# EasyEDA schematic SCH_vga1306-v3_2021-08-20.json
TITLE: Sheet_1; REV: 1.0; Date: 2021-06-19; Sheet: 1/1; Drawn By: ande3367; Company: Your Company
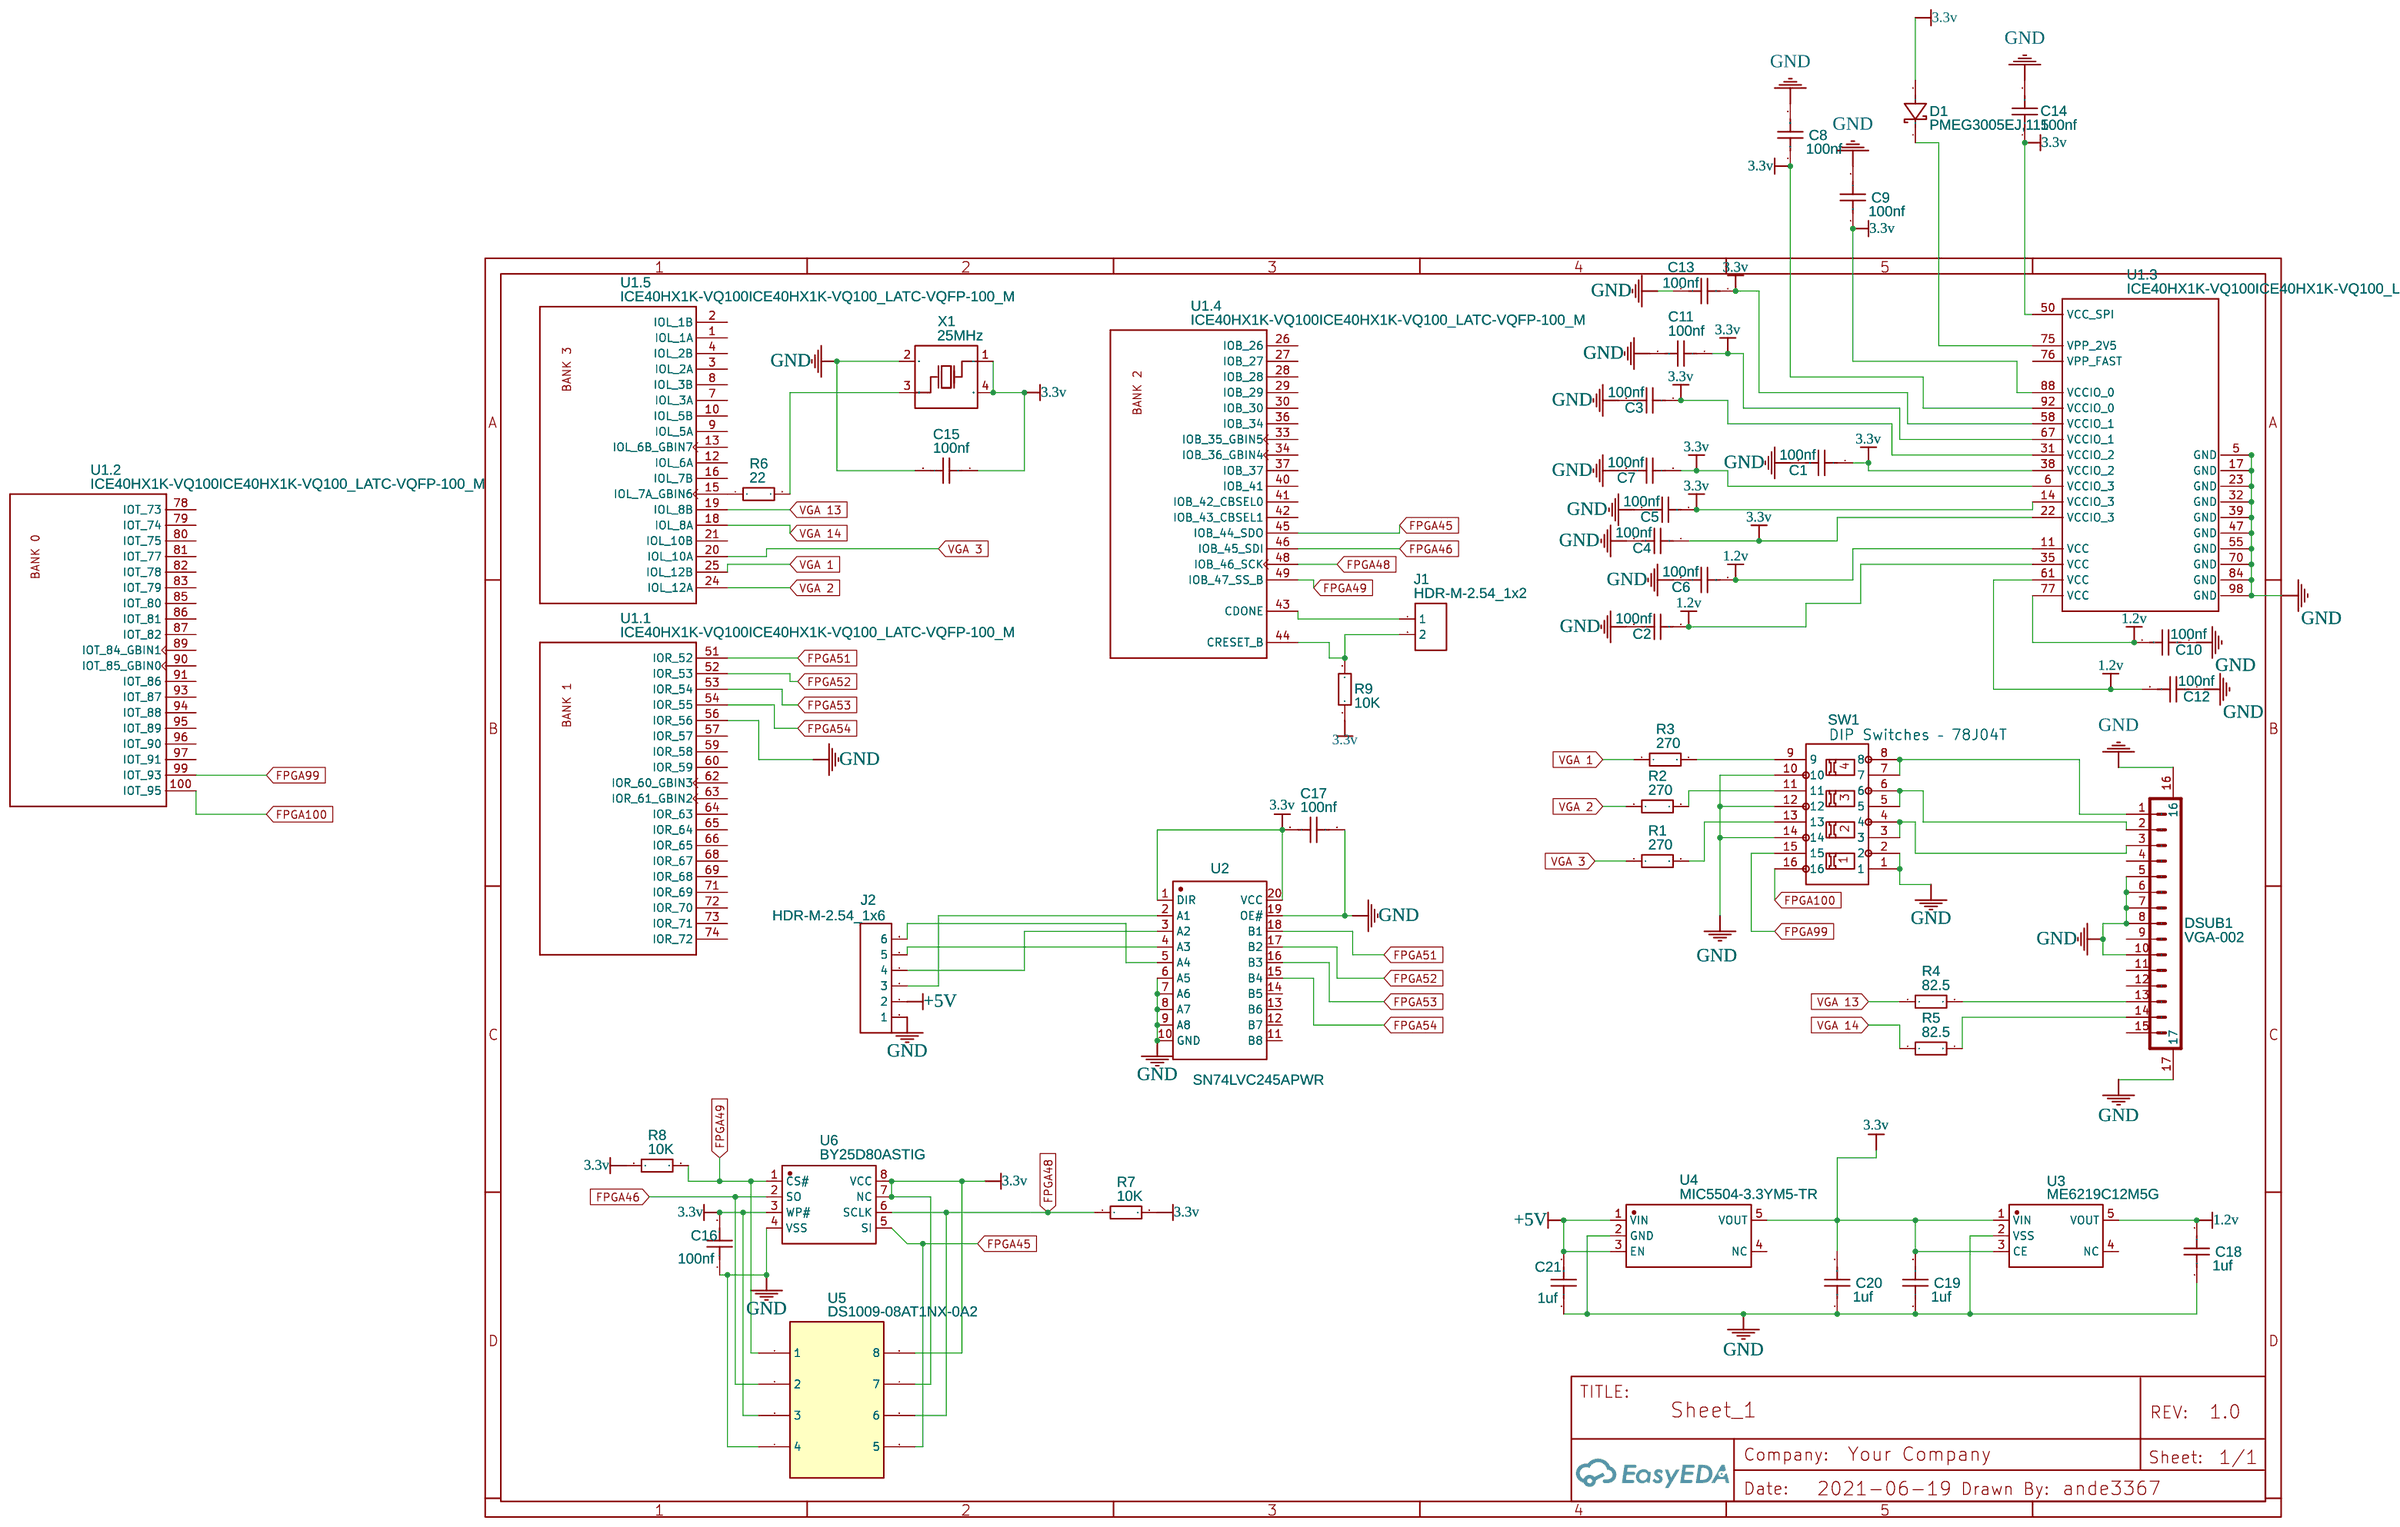
[diagram p0: schematic sheet]

## Parts
C1  100nf  [0603]
C2  100nf  [0603]
C3  100nf  [0603]
C4  100nf  [0603]
C5  100nf  [0603]
C6  100nf  [0603]
C7  100nf  [0603]
C8  100nf  [0603]
C9  100nf  [0603]
C10  100nf  [0603]
C11  100nf  [0603]
C12  100nf  [0603]
C13  100nf  [0603]
C14  100nf  [0603]
C15  100nf  [0603]
C16  100nf  [0603]
C17  100nf  [0603]
C18  1uf  [0603]
C19  1uf  [0603]
C20  1uf  [0603]
C21  1uf  [0603]
D1  PMEG3005EJ,115  [SOD-323F_L2.0-W1.6-LS2.5-RD]
DSUB1  VGA-002  [D-SUB-TH_VGA-002]
J1  HDR-M-2.54_1x2  [HDR-M-2.54_1X2]
J2  HDR-M-2.54_1x6  [HDR-M-2.54_1X6]
R1  270  [R0603]
R2  270  [R0603]
R3  270  [R0603]
R4  82.5  [R0603]
R5  82.5  [R0603]
R6  22  [R0603]
R7  10K  [R0603]
R8  10K  [R0603]
R9  10K  [R0603]
SW1  DIP Switches – 78J04T  [DIP SWITCHES – 78J04T]
U1  ICE40HX1K-VQ100ICE40HX1K-VQ100_LATC-VQFP-100_M  [LATC-VQFP-100_M]  (sections 1,2,3,4,5)
U2  SN74LVC245APWR  [TSSOP-20_L6.5-W4.4-P0.65-LS6.4-BL]
U3  ME6219C12M5G  [SOT-23-5_L3.0-W1.7-P0.95-LS2.8-BR]
U4  MIC5504-3.3YM5-TR  [SOT-23-5_L3.0-W1.7-P0.95-LS2.8-TL]
U5  DS1009-08AT1NX-0A2  [DIP-8_L10.0-W6.5-P2.54-LS7.6-BL]
U6  BY25D80ASTIG  [SOP-8_L4.9-W3.9-P1.27-LS6.0-BL]
X1  25MHz  [OSC-SMD_4P-L3.2-W2.5-BL]

## Library data of the parts
C1-C17 = Cap_0603_US: Supplier Part: C92490; Supplier: LCSC
C18-C21 = Cap_0603_US: Supplier Part: C26413; Supplier: LCSC
D1 = PMEG3005EJ,115: Supplier: LCSC; Supplier Part: C552853; Manufacturer: Nexperia; Contributor: LCSC
DSUB1 = VGA-002: Supplier: LCSC; Manufacturer: BOOMELE; Supplier Part: C138387; JLCPCB Part Class: Extended Part
J1 = HDR-M-2.54_1x2: Supplier Part: C124375; Supplier: LCSC; Contributor: LCEDA_Lib
J2 = HDR-M-2.54_1x6: Supplier Part: C190819; Supplier: LCSC; Contributor: LCEDA_Lib
R1-R3 = PTFR0603B270RP9: Supplier: LCSC; Supplier Part: C351661; Manufacturer: ResistorToday; Contributor: LCSC; JLCPCB Part Class: Extended Part
R4 R5 = 0603WAF825JT5E_C23117: Supplier: LCSC; Manufacturer: UniOhm; Manufacturer Part: 0603WAF825JT5E; Supplier Part: C23117; JLCPCB Part Class: Extended Part
R6 = 0603WAF220JT5E: Supplier: LCSC; Manufacturer: UniOhm; Supplier Part: C23345; JLCPCB Part Class: Basic Part
R7-R9 = 0603WAF1002T5E: Supplier: LCSC; Manufacturer: UniOhm; Supplier Part: C25804; JLCPCB Part Class: Basic Part
SW1 = DIP Switches – 78J04T: Manufacturer Part: DIP Switches – 78J06T; Contributor: components
U1 = ICE40HX1K-VQ100ICE40HX1K-VQ100_LATC-VQFP-100_M: Contributor: Darwin Sanjaya; subpart_no: 3; Supplier: LCSC; Supplier Part: C1519043
U2 = SN74LVC245APWR: Supplier: LCSC; Manufacturer: TI; Supplier Part: C7848; JLCPCB Part Class: Extended Part
U3 = ME6219C12M5G: Supplier: LCSC; Supplier Part: C236651; Manufacturer: Nanjing Micro One Elec; Contributor: LCSC; JLCPCB Part Class: Extended Part
U4 = MIC5504-3.3YM5-TR: Supplier: LCSC; Manufacturer: MICROCHIP; Contributor: LCSC; Supplier Part: C88419; JLCPCB Part Class: Extended Part
U5 = DS1009-08AT1NX-0A2: Supplier: LCSC; Manufacturer: CONNFLY; Supplier Part: C72124; JLCPCB Part Class: Extended Part
U6 = BY25D80ASTIG: Supplier: LCSC; Supplier Part: C383790; Manufacturer: BOYAMICRO; Contributor: LCSC; JLCPCB Part Class: Extended Part
X1 = S3225000151040: Supplier: LCSC; Supplier Part: C426979; Manufacturer: JGHC; Contributor: LCSC

## Nets
1.2v: C2.1 C6.1 C10.2 C12.2 C18.2 U1.11(VCC) U1.35(VCC) U1.61(VCC) U1.77(VCC) U3.5(VOUT)
3.3v: C1.1 C3.1 C4.1 C5.1 C7.1 C8.1 C9.1 C11.1 C13.1 C14.1 C15.1 C16.2 C17.2 C19.2 C20.2 D1.2(A) R7.2 R8.1 R9.1 U1.6(VCCIO_3) U1.14(VCCIO_3) U1.22(VCCIO_3) U1.31(VCCIO_2) U1.38(VCCIO_2) U1.50(VCC_SPI) U1.58(VCCIO_1) U1.67(VCCIO_1) U1.88(VCCIO_0) U1.92(VCCIO_0) U2.1(DIR) U2.20(VCC) U3.1(VIN) U3.3(CE) U4.5(VOUT) U5.3 U5.7 U5.8 U6.3(WP#) U6.7(NC) U6.8(VCC) X1.1(OSC1) X1.4(GND)
+5V: C21.2 J2.2 U4.1(VIN) U4.3(EN)
GND: C1.2 C2.2 C3.2 C4.2 C5.2 C6.2 C7.2 C8.2 C9.2 C10.1 C11.2 C12.1 C13.2 C14.2 C15.2 C16.1 C17.1 C18.1 C19.1 C20.1 C21.1 DSUB1.5 DSUB1.6 DSUB1.7 DSUB1.8 DSUB1.10 DSUB1.16 DSUB1.17 J2.1 SW1.1 SW1.2 SW1.10 SW1.12 SW1.14 U1.5(GND) U1.17(GND) U1.23(GND) U1.32(GND) U1.39(GND) U1.47(GND) U1.55(GND) U1.56(IOR) U1.70(GND) U1.84(GND) U1.98(GND) U2.6(A5) U2.7(A6) U2.8(A7) U2.9(A8) U2.10(GND) U2.19(OE#) U3.2(VSS) U4.2(GND) U5.4 U6.4(VSS) X1.2(GND)
FPGA45: U1.45(IOB_44_SDO) U5.5 U6.5(SI)
FPGA46: U1.46(IOB_45_SDI) U5.2 U6.2(SO)
FPGA48: R7.1 U1.48(IOB_46_SCK) U5.6 U6.6(SCLK)
FPGA49: R8.2 U1.49(IOB_47_SS_B) U5.1 U6.1(CS#)
FPGA51: U1.51(IOR_52) U2.18(B1)
FPGA52: U1.52(IOR_53) U2.17(B2)
FPGA53: U1.53(IOR_54) U2.16(B3)
FPGA54: U1.54(IOR_55) U2.15(B4)
FPGA99: SW1.15 U1.99(IOT_93)
FPGA100: SW1.16 U1.100(IOT_95)
VGA 1: R3.1 U1.25(IOL_12B)
VGA 2: R2.1 U1.24(IOL_12A)
VGA 3: R1.1 U1.20(IOL_10A)
VGA 13: R4.1 U1.19(IOL_8B)
VGA 14: R5.1 U1.18(IOL_8A)
Net-(D1-1): D1.1(C) U1.75(VPP_2V5)
Net-(DSUB1-1): DSUB1.1 SW1.7 SW1.8
Net-(DSUB1-2): DSUB1.2 SW1.5 SW1.6
Net-(DSUB1-3): DSUB1.3 SW1.3 SW1.4
Net-(DSUB1-13): DSUB1.13 R4.2
Net-(DSUB1-14): DSUB1.14 R5.2
Net-(J1-1): J1.1 U1.43(CDONE)
Net-(J1-2): J1.2 R9.2 U1.44(CRESET_B)
Net-(J2-3): J2.3 U2.2(A1)
Net-(J2-4): J2.4 U2.3(A2)
Net-(J2-5): J2.5 U2.4(A3)
Net-(J2-6): J2.6 U2.5(A4)
Net-(R1-2): R1.2 SW1.13
Net-(R2-2): R2.2 SW1.11
Net-(R3-2): R3.2 SW1.9
Net-(R6-1): R6.1 U1.15(IOL_7A_GBIN6)
Net-(R6-2): R6.2 X1.3(OSC2)

Not connected (* = marked no-connect by the designer): DSUB1 4 9 11 12 15; U1 1(IOL_1A) 2(IOL_1B) 3(IOL_2A) 4(IOL_2B) 7(IOL_3A) 8(IOL_3B) 9(IOL_5A) 10(IOL_5B) 12(IOL_6A) 13(IOL_6B_GBIN7) 16(IOL_7B) 21(IOL_10B) 26(IOB) 27(IOB) 28(IOB) 29(IOB) 30(IOB) 33(IOB_35_GBIN5) 34(IOB_36_GBIN4) 36(IOB_34) 37(IOB) 40(IOB_41) 41(IOB_42_CBSEL0) 42(IOB_43_CBSEL1) 57(IOR) 59(IOR_58) 60(IOR_59) 62(IOR_60_GBIN3) 63(IOR_61_GBIN2) 64(IOR_63) 65(IOR_64) 66(IOR_65) 68(IOR_67) 69(IOR_68) 71(IOR_69) 72(IOR_70) 73(IOR_71) 74(IOR_72) 76(VPP_FAST) 78(IOT_73) 79(IOT_74) 80(IOT_75) 81(IOT_77) 82(IOT_78) 83(IOT_79) 85(IOT_80) 86(IOT_81) 87(IOT_82) 89(IOT_84_GBIN1) 90(IOT_85_GBIN0) 91(IOT_86) 93(IOT_87) 94(IOT_88) 95(IOT_89) 96(IOT_90) 97(IOT_91); U2 11(B8) 12(B7) 13(B6) 14(B5); U3 4(NC); U4 4(NC)
